# Altium schematic sheet WiFi.SchDoc: WiFi
size A3; Organization: CU Boulder; DocumentNumber: 008; Revision: 1.1; SheetNumber: 8; SheetTotal: 8
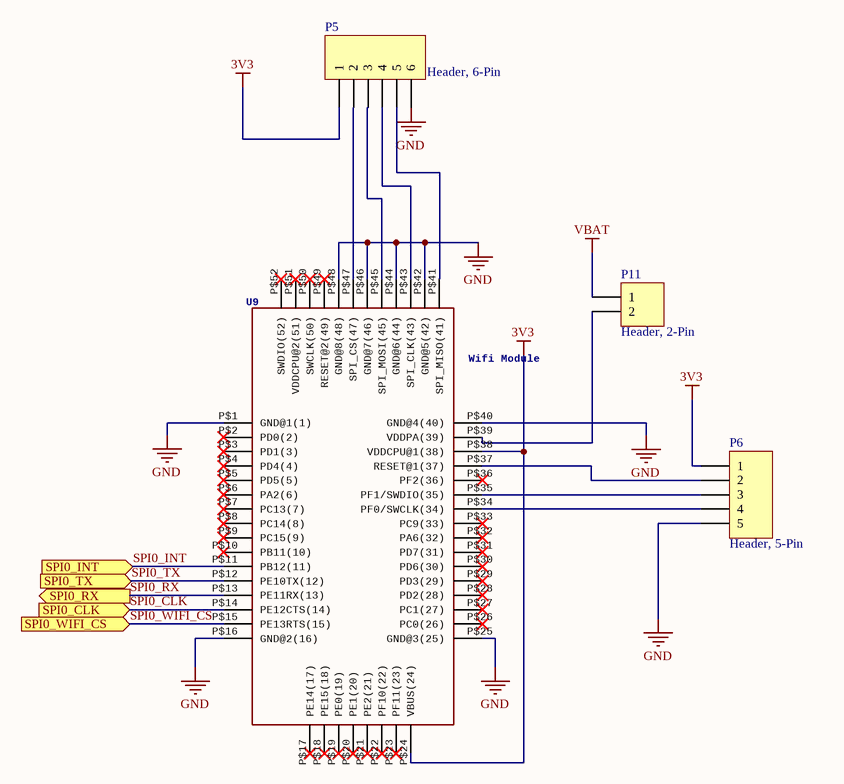
[diagram p0: WiFi.SchDoc]

## Parts
P5  Header, 6-Pin  [HDR1X6]
P6  Header, 5-Pin  [HDR1X5]
P11  Header, 2-Pin  [HDR1X2]
U9  Wifi Module  [WGM110_PAC]

## Ports
SPI0_CLK (in), SPI0_INT (in), SPI0_RX (out), SPI0_TX (in), SPI0_WIFI_CS (in)

## Nets
3V3: P5.1 P6.1 U9.P$24(VBUS(24)) U9.P$38(VDDCPU@1(38))
GND: P5.6 P6.5 U9.P$1(GND@1(1)) U9.P$16(GND@2(16)) U9.P$25(GND@3(25)) U9.P$40(GND@4(40)) U9.P$42(GND@5(42)) U9.P$44(GND@6(44)) U9.P$46(GND@7(46)) U9.P$48(GND@8(48))
VBAT: P11.1
SPI0_CLK: U9.P$14(PE12CTS(14)) ; port SPI0_CLK
SPI0_INT: U9.P$11(PB12(11)) ; port SPI0_INT
SPI0_RX: U9.P$13(PE11RX(13)) ; port SPI0_RX
SPI0_TX: U9.P$12(PE10TX(12)) ; port SPI0_TX
SPI0_WIFI_CS: U9.P$15(PE13RTS(15)) ; port SPI0_WIFI_CS
NetP5_2: P5.2 U9.P$47(SPI_CS(47))
NetP5_3: P5.3 U9.P$45(SPI_MOSI(45))
NetP5_4: P5.4 U9.P$43(SPI_CLK(43))
NetP5_5: P5.5 U9.P$41(SPI_MISO(41))
NetP6_2: P6.2 U9.P$37(RESET@1(37))
NetP6_3: P6.3 U9.P$35(PF1/SWDIO(35))
NetP6_4: P6.4 U9.P$34(PF0/SWCLK(34))
NetP11_2: P11.2 U9.P$39(VDDPA(39))

Not connected (* = marked no-connect by the designer): U9 P$2(PD0(2))* P$3(PD1(3))* P$4(PD4(4))* P$5(PD5(5))* P$6(PA2(6))* P$7(PC13(7))* P$8(PC14(8))* P$9(PC15(9))* P$10(PB11(10))* P$17(PE14(17))* P$18(PE15(18))* P$19(PE0(19))* P$20(PE1(20))* P$21(PE2(21))* P$22(PF10(22))* P$23(PF11(23))* P$26(PC0(26))* P$27(PC1(27))* P$28(PD2(28))* P$29(PD3(29))* P$30(PD6(30))* P$31(PD7(31))* P$32(PA6(32))* P$33(PC9(33))* P$36(PF2(36))* P$49(RESET@2(49))* P$50(SWCLK(50))* P$51(VDDCPU@2(51))* P$52(SWDIO(52))*

## Notes on the sheet
- Title
- Size:
- Date:
- A3
- Number:
- Time:
- Revision:
- Sheet
- of
- File:

## Library data of the parts
P5 = Header 6: LatestRevisionDate: 17-Jul-2002; LatestRevisionNote: Re-released for DXP Platform.; Publisher: Altium Limited
P6 = Header 5: LatestRevisionDate: 17-Jul-2002; LatestRevisionNote: Re-released for DXP Platform.; Publisher: Altium Limited
P11 = Header 2: LatestRevisionDate: 17-Jul-2002; LatestRevisionNote: Re-released for DXP Platform.; Publisher: Altium Limited
U9 = WGM110_DEV: Supplier 1: Digi-Key; Supplier Part Number 1: 336-4136-1-ND; Supplier 2: Digi-Key